# Altium schematic sheet USB.SchDoc
size A4
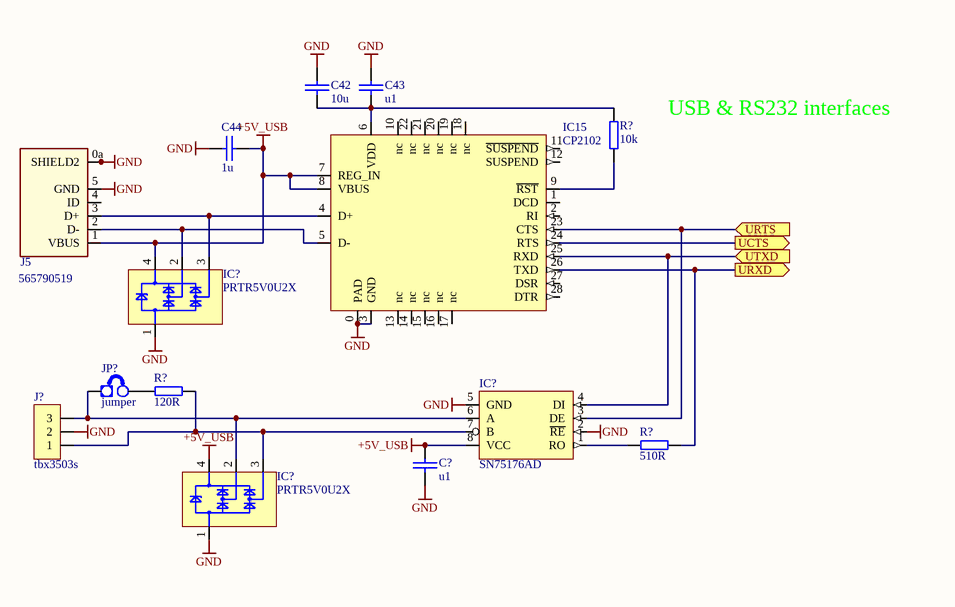
[diagram p0: USB.SchDoc]

## Parts
(Parts that share a designator on the sheet are numbered #1, #2 ... from top to bottom, then left to right.)
C42  10u  [1206]
C43  u1  [0603]
C44  1u  [0805]
C?  u1  [0603C]
IC15  CP2102  [QFN28]
IC?#1  PRTR5V0U2X  [sot143b]
IC?#2  SN75176AD  [SO-8]
IC?#3  PRTR5V0U2X  [sot143b]
J5  565790519  [CON_USB_565790519]
J?  tbx3503s  [tbx3503s]
JP?  jumper  [jump]
R?#1  10k  [0603R]
R?#2  120R  [0603R]
R?#3  510R  [0603R]

## Ports
UCTS (out), URTS (in), URXD (out), UTXD (in)

## Nets
+5V_USB: C44.2 C?.1 IC15.7(REG_IN) IC15.8(VBUS) IC?#1.4 IC?#2.8(VCC) IC?#3.4 J5.1(VBUS)
GND: C42.2 C43.2 C44.1 C?.2 IC15.0(PAD) IC15.3(GND) IC?#1.1 IC?#2.2(~{RE}) IC?#2.5(GND) IC?#3.1 J5.0(SHIELD2) J5.0a(SHIELD2) J5.5(GND) J?.2
UCTS: IC15.24(RTS) ; port UCTS
URTS: IC15.23(CTS) IC?#2.3(DE) ; port URTS
URXD: IC15.26(TXD) R?#3.1 ; port URXD
UTXD: IC15.25(RXD) IC?#2.4(DI) ; port UTXD
NetC42_1: C42.1 C43.1 IC15.6(VDD) R?#1.2
NetIC15_4: IC15.4(D+) IC?#1.3 J5.3(D+)
NetIC15_5: IC15.5(D-) IC?#1.2 J5.2(D-)
NetIC15_9: IC15.9(~{RST}) R?#1.1
NetIC?#2_1: IC?#2.1(RO) R?#3.2
NetIC?#2_6: IC?#2.6(A) IC?#3.2 J?.3 JP?.1(E1)
NetIC?#2_7: IC?#2.7(B) IC?#3.3 J?.1 R?#2.2
NetJP?_2: JP?.2(E2) R?#2.1

Not connected (* = marked no-connect by the designer): IC15 1(DCD) 2(RI) 10(nc) 11(~{SUSPEND}) 12(SUSPEND) 13(nc) 14(nc) 15(nc) 16(nc) 17(nc) 18(nc) 19(nc) 20(nc) 21(nc) 22(nc) 27(DSR) 28(DTR); J5 4(ID)

## Notes on the sheet
- USB & RS232 interfaces

## Library data of the parts
C42-C44 = CAP_SMD: Capacitor SMD
C? = CAP_SMD_0603: Capacitor SMD
IC?#1 IC?#3 = D_TVS_PRTR5V0U2X: dual 5.5 ESD transient voltage suppressor
IC?#2 = IFC_SN75176AD: DIFFERENTIAL BUS TRANSCEIVER
J5 = CON_USB_B_MINI_TH: USB mini B connector (Molex); Part Number: 10133; Device: USB_Mini_AB
J? = CON_TB3: Terminal Block
R?#1-R?#3 = RES_0603: SMD Resistor